# EAGLE design PSU only (EAGLE 9.6.2)

## Sheet 1 of 2
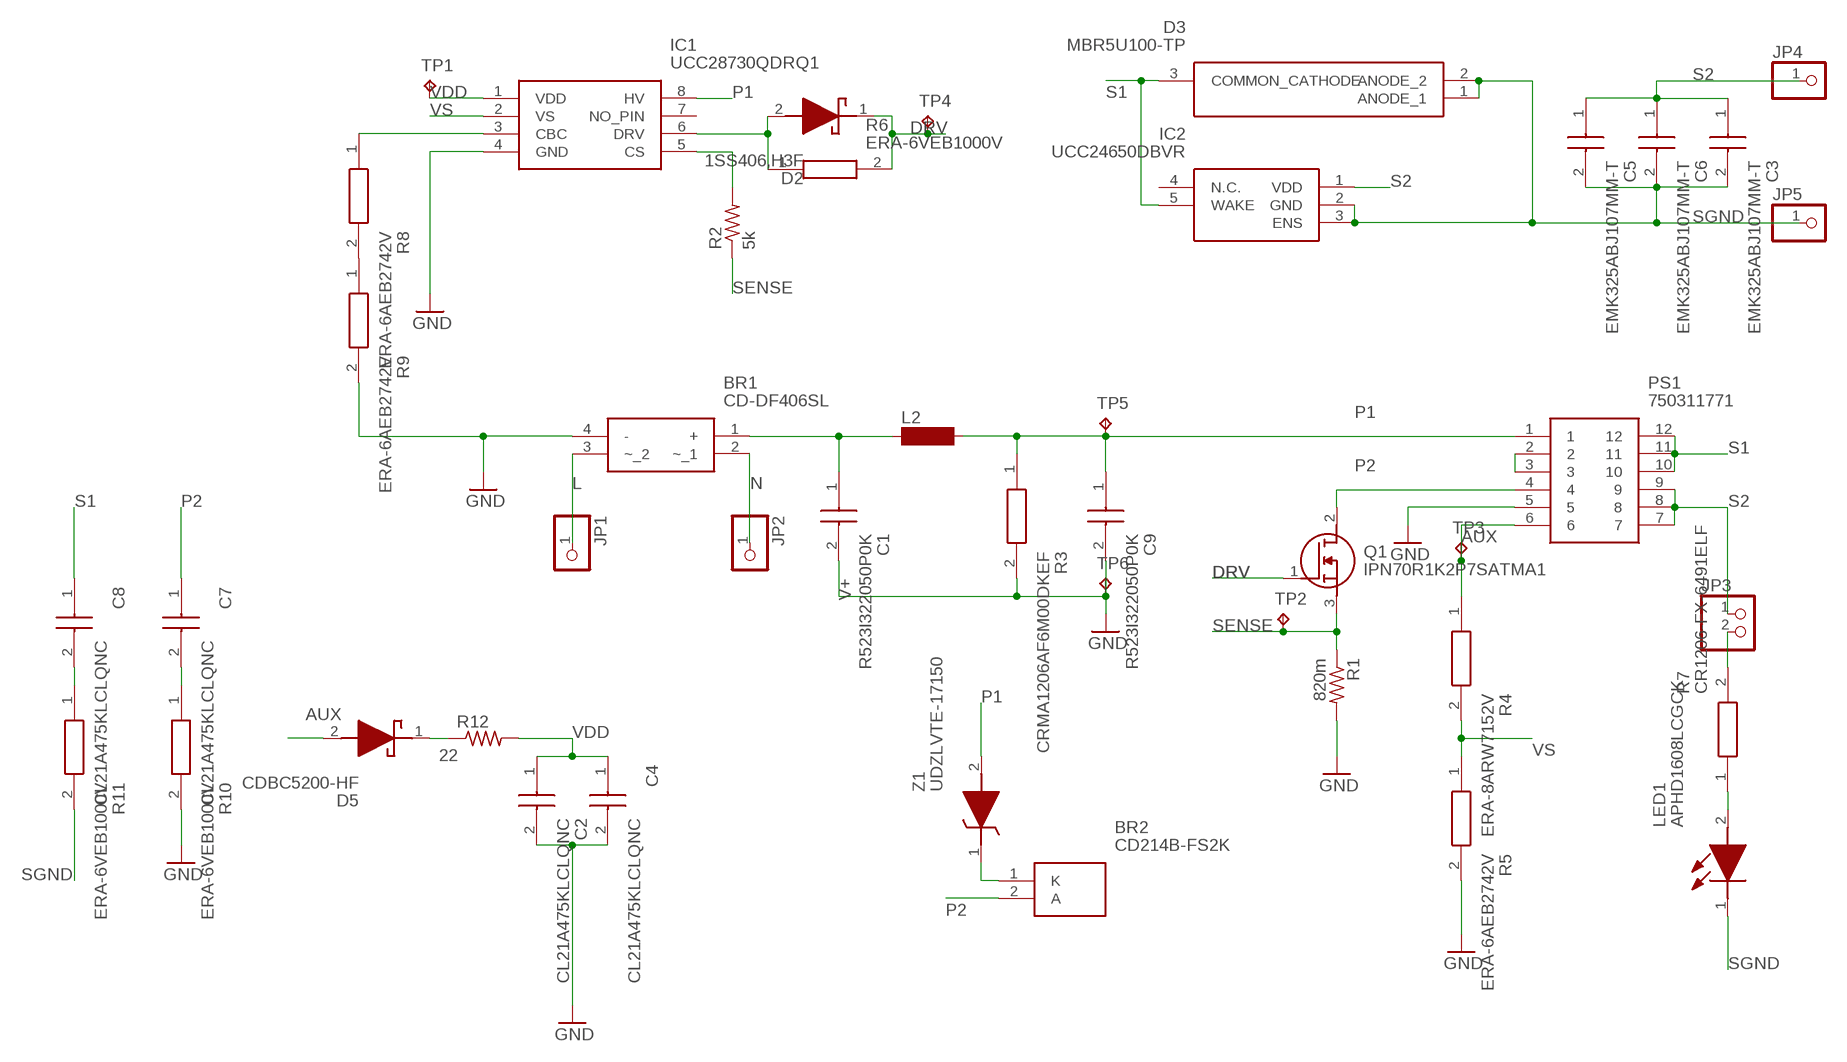
[diagram p0: schematic, sheet 1]

### Parts
BR1  CD-DF406SL  [CDDF406SL]
BR2  CD214B-FS2K  [CD214BFS2K]
C1  R523I322050P0K  [HDRV2W65P0X1500_1X2_1790X585X1]
C2  CL21A475KLCLQNC  [CAPC2012X95N]
C3  EMK325ABJ107MM-T  [CAPC3225X270N]
C4  CL21A475KLCLQNC  [CAPC2012X95N]
C5  EMK325ABJ107MM-T  [CAPC3225X270N]
C6  EMK325ABJ107MM-T  [CAPC3225X270N]
C7  CL21A475KLCLQNC  [CAPC2012X95N]
C8  CL21A475KLCLQNC  [CAPC2012X95N]
C9  R523I322050P0K  [HDRV2W65P0X1500_1X2_1790X585X1]
D2  1SS406,H3F  [SOD2513X115N]
D3  MBR5U100-TP  [MBR5U100TP]
D5  CDBC5200-HF  [DIOM8059X290N]
IC1  UCC28730QDRQ1  [SOIC127P600X175-8N]
IC2  UCC24650DBVR  [SOT95P280X145-5N]
JP1  PINHD-1X1  [1X01]
JP2  PINHD-1X1  [1X01]
JP3  PINHD-1X2  [1X02]
JP4  PINHD-1X1  [1X01]
JP5  PINHD-1X1  [1X01]
L2  MS50SRU1048-471Y  [INDDFN1000X1000X480-2N]
LED1  APHD1608LCGCK  [LEDM168X80N]
PS1  750311771  [750311771]
Q1  IPN70R1K2P7SATMA1  [IPN70R1K2P7SATMA1]
R1  820m  R-US_R0805  [R0805]
R2  5k  R-US_R0805  [R0805]
R3  CRMA1206AF6M00DKEF  [RESC3216X74N]
R4  ERA-8ARW7152V  [ERA8A_(0805)]
R5  ERA-6AEB2742V  [ERA6A_(0805)]
R6  ERA-6VEB1000V  [ERA6VK]
R7  CR1206-FX-6491ELF  [RESC3216X75N]
R8  ERA-6AEB2742V  [ERA6A_(0805)]
R9  ERA-6AEB2742V  [ERA6A_(0805)]
R10  ERA-6VEB1000V  [ERA6VK]
R11  ERA-6VEB1000V  [ERA6VK]
R12  22  R-US_R0805  [R0805]
TP1  TPB1,27  [B1,27]
TP2  TPB1,27  [B1,27]
TP3  TPB1,27  [B1,27]
TP4  TPB1,27  [B1,27]
TP5  TPB1,27  [B1,27]
TP6  TPB1,27  [B1,27]
Z1  UDZLVTE-17150  [SODFL2512X90N]

### Nets
AUX: D5.2(A) PS1.6 R4.1 TP3.TP
DRV: D2.1(K) Q1.1(G) R6.2 TP4.TP
GND: BR1.4(-) C1.2 C2.2 C4.2 C9.2 IC1.4(GND) PS1.5 R1.2 R3.2 R5.2 R9.2 R10.2 TP6.TP
L: BR1.3(~_2) JP1.1
N: BR1.2(~_1) JP2.1
N$1: IC1.5(CS) R2.2
N$2: C7.2 R10.1
N$3: C8.2 R11.1
N$4: D5.1(K) R12.1
N$5: PS1.2 PS1.3
N$6: BR2.1(K) Z1.1(K)
N$7: D2.2(A) IC1.6(DRV) R6.1
N$8: R8.2 R9.1
N$9: LED1.2(A) R7.1
N$10: IC1.3(CBC) R8.1
N$11: JP3.2 R7.2
P1: C9.1 IC1.8(HV) L2.2 PS1.1 R3.1 TP5.TP Z1.2(A)
P2: BR2.2(A) C7.1 PS1.4 Q1.2(D)
S1: C8.1 D3.3(COMMON_CATHODE) IC2.5(WAKE) PS1.10 PS1.11 PS1.12
S2: C3.1 C5.1 C6.1 IC2.1(VDD) JP3.1 JP4.1 PS1.7 PS1.8 PS1.9
SENSE: Q1.3(S) R1.1 R2.1 TP2.TP
SGND: C3.2 C5.2 C6.2 D3.1(ANODE_1) D3.2(ANODE_2) IC2.2(GND) IC2.3(ENS) JP5.1 LED1.1(K) R11.2
V+: BR1.1(+) C1.1 L2.1
VDD: C2.1 C4.1 IC1.1(VDD) R12.2 TP1.TP
VS: IC1.2(VS) R4.2 R5.1
Unconnected: IC1.7(NO_PIN) IC2.4(N.C.)

## Sheet 2 of 2

## Library data of the parts
BR1 = CD-DF406SL:CD-DF406SL: Bridge Rectifiers VRRM 600V 4A SMD DFS Bridge Rectifier Source: Datasheet <http://www.bourns.com/docs/Product-Datasheets/CD-DF4xxSL.pdf>; DESCRIPTION: Bridge Rectifiers VRRM 600V 4A SMD DFS Bridge Rectifier; HEIGHT: 1.55mm; MANUFACTURER_NAME: Bourns; MANUFACTURER_PART_NUMBER: CD-DF406SL; MOUSER_PART_NUMBER: 652-CD-DF406SL; MOUSER_PRICE-STOCK: https://www.mouser.co.uk/ProductDetail/Bourns/CD-DF406SL?qs=zwwtnr6GuIwJRuaaRN0u3A%3D%3D
BR2 = CD214B-FS2K:CD214B-FS2K: Rectifiers 800V 2A Source: Datasheet <http://www.bourns.com/docs/product-datasheets/CD214B-FS2x.pdf>; DESCRIPTION: Rectifiers 800V 2A; HEIGHT: 1.25mm; MANUFACTURER_NAME: Bourns; MANUFACTURER_PART_NUMBER: CD214B-FS2K; MOUSER_PART_NUMBER: 652-CD214B-FS2K; MOUSER_PRICE-STOCK: https://www.mouser.co.uk/ProductDetail/Bourns/CD214B-FS2K?qs=f9yNj16SXrLQSBa%252BXyEv0g%3D%3D
C1 C9 = R523I322050P0K:R523I322050P0K: R52 310 VAC MINI, Film, Metallized Polypropylene, Automotive Safety, 0.22 uF, 10%, 310 VAC, 310 VAC (X2), 310 VAC, 630 VDC, 110C, -40C, 110C, 0.2 % , 100 GOhms, 400 V/us, 2, 1.6 g, 18mm, 12mm, 6mm, Lead Spacing = 15mm, 900 Source: Datasheet <https://content.kemet.com/datasheets/KEM_F3123_R52_X2_310_110C_MIN.pdf>; DESCRIPTION: R52 310 VAC MINI, Film, Metallized Polypropylene, Automotive Safety, 0.22 uF, 10%, 310 VAC, 310 VAC (X2), 310 VAC, 630 VDC, 110C, -40C, 110C, 0.2 % , 100 GOhms, 400 V/us, 2, 1.6 g, 18mm, 12mm, 6mm, Lead Spacing = 15mm, 900; HEIGHT: 12.4mm; MANUFACTURER_NAME: KEMET; MANUFACTURER_PART_NUMBER: R523I322050P0K
C2 C4 C7 C8 = CL21A475KLCLQNC:CL21A475KLCLQNC: CL21A475KLCLQNC Source: Datasheet <https://datasheet.datasheetarchive.com/originals/dk/DKDS-19/374306.pdf>; DESCRIPTION: CL21A475KLCLQNC; HEIGHT: 0.95mm; MANUFACTURER_NAME: SAMSUNG; MANUFACTURER_PART_NUMBER: CL21A475KLCLQNC; MOUSER_PART_NUMBER: 187-CL21A475KLCLQNC; MOUSER_PRICE-STOCK: https://www.mouser.co.uk/ProductDetail/Samsung-Electro-Mechanics/CL21A475KLCLQNC?qs=xZ%2FP%252Ba9zWqblbGH9u%2F3CcQ%3D%3D
C3 C5 C6 = EMK325ABJ107MM-T:EMK325ABJ107MM-T: TAIYO YUDEN - EMK325ABJ107MM-T - CAP, MLCC, X5R, 100UF, 16V, 1210 Source: Datasheet <https://componentsearchengine.com/Datasheets/2/EMK325ABJ107MM-T.pdf>; DESCRIPTION: TAIYO YUDEN - EMK325ABJ107MM-T - CAP, MLCC, X5R, 100UF, 16V, 1210; HEIGHT: 2.7mm; MANUFACTURER_NAME: TAIYO YUDEN; MANUFACTURER_PART_NUMBER: EMK325ABJ107MM-T; MOUSER_PART_NUMBER: 963-EMK325ABJ107MM-T; MOUSER_PRICE-STOCK: https://www.mouser.co.uk/ProductDetail/Taiyo-Yuden/EMK325ABJ107MM-T?qs=I6KAKw0tg2y0ShKbEoYruw%3D%3D
D2 = 1SS406_H3F:1SS406,H3F: Small Signal Schottky Barrier Diode VR=20V, IO=0.05A, in SOD-323 package Source: Datasheet <https://www.mouser.fr/datasheet/2/408/1SS406_datasheet_en_20140301-1853419.pdf>; DESCRIPTION: Small Signal Schottky Barrier Diode VR=20V, IO=0.05A, in SOD-323 package; HEIGHT: 1.15mm; MANUFACTURER_NAME: Toshiba; MANUFACTURER_PART_NUMBER: 1SS406,H3F; MOUSER_PART_NUMBER: 757-1SS406H3F; MOUSER_PRICE-STOCK: https://www.mouser.co.uk/ProductDetail/Toshiba/1SS406H3F?qs=bZr6mbWTK5l7KVDflTlTGA%3D%3D
D3 = MBR5U100-TP:MBR5U100-TP: Diode Schottky 100 V 5A Surface Mount TO-277 Source: Datasheet <https://www.mccsemi.com/pdf/Products/MBR5U100(TO-277).pdf>; DESCRIPTION: Diode Schottky 100 V 5A Surface Mount TO-277; HEIGHT: 1.2mm; MANUFACTURER_NAME: MCC; MANUFACTURER_PART_NUMBER: MBR5U100-TP
D5 = CDBC5200-HF:CDBC5200-HF: Diode 200 V 5A Surface Mount DO-214AB (SMC) Source: Datasheet <https://www.comchiptech.com/admin/files/product/CDBC5150-HF Thru913202. CDBC5200-HF RevB.pdf>; DESCRIPTION: Diode 200 V 5A Surface Mount DO-214AB (SMC); HEIGHT: 2.9mm; MANUFACTURER_NAME: Comchip Technology; MANUFACTURER_PART_NUMBER: CDBC5200-HF; MOUSER_PART_NUMBER: 750-CDBC5200-HF; MOUSER_PRICE-STOCK: https://www.mouser.co.uk/ProductDetail/Comchip-Technology/CDBC5200-HF?qs=XEIV%2Fho1H6e7FEPE4wQmfQ%3D%3D
IC1 = UCC28730QDRQ1:UCC28730QDRQ1: Zero-Power Standby PSR Flyback Controller for Automotive Source: Datasheet <http://www.ti.com/lit/gpn/ucc28730-q1>; DESCRIPTION: Zero-Power Standby PSR Flyback Controller for Automotive; HEIGHT: 1.75mm; MANUFACTURER_NAME: Texas Instruments; MANUFACTURER_PART_NUMBER: UCC28730QDRQ1; MOUSER_PART_NUMBER: 595-UCC28730QDRQ1; MOUSER_PRICE-STOCK: https://www.mouser.co.uk/ProductDetail/Texas-Instruments/UCC28730QDRQ1?qs=HXFqYaX1Q2wArPNWbLj35A%3D%3D
IC2 = UCC24650DBVR:UCC24650DBVR: 200-V Wake-up Monitor for Fast Transient Primary-side Regulation Source: Datasheet <http://www.ti.com/lit/gpn/ucc24650>; DESCRIPTION: 200-V Wake-up Monitor for Fast Transient Primary-side Regulation; HEIGHT: 1.45mm; MANUFACTURER_NAME: Texas Instruments; MANUFACTURER_PART_NUMBER: UCC24650DBVR; MOUSER_PART_NUMBER: 595-UCC24650DBVR; MOUSER_PRICE-STOCK: https://www.mouser.co.uk/ProductDetail/Texas-Instruments/UCC24650DBVR?qs=Lb6%252B0IsOw48DAHpAvVALpw%3D%3D
JP1 JP2 JP4 JP5 = adafruit:PINHD-1X1: Pin header 1x1 for 0.1" spacing With round pins
JP3 = pinhead:PINHD-1X2: PIN HEADER
L2 = inductor-neosid:MS50: INDUCTOR SMD power inductor
LED1 = APHD1608LCGCK:APHD1608LCGCK: Standard LEDs - SMD 0603 Dome Lens LED Green- 570nm Source: Datasheet <http://www.kingbrightusa.com/images/catalog/SPEC/APHD1608LCGCK.pdf>; DESCRIPTION: Standard LEDs - SMD 0603 Dome Lens LED Green- 570nm; HEIGHT: 0.8mm; MANUFACTURER_NAME: Kingbright; MANUFACTURER_PART_NUMBER: APHD1608LCGCK; MOUSER_PART_NUMBER: 604-APHD1608LCGCK; MOUSER_PRICE-STOCK: https://www.mouser.co.uk/ProductDetail/Kingbright/APHD1608LCGCK?qs=AQlKX63v8RvqPbV1LDSVuw%3D%3D
PS1 = 750311771:750311771: Power Transformers WE-FB Flyback 500uH 3A 15V Source: Datasheet <https://katalog.we-online.com/pbs/datasheet/750311771.pdf>; DESCRIPTION: Power Transformers WE-FB Flyback 500uH 3A 15V; HEIGHT: 13.69mm; MANUFACTURER_NAME: Wurth Elektronik; MANUFACTURER_PART_NUMBER: 750311771; MOUSER_PART_NUMBER: 710-750311771; MOUSER_PRICE-STOCK: https://www.mouser.co.uk/ProductDetail/Wurth-Elektronik/750311771?qs=J4sk5G6CMwYUnCXRsU%2FeCw%3D%3D; SPICEPREFIX: X
Q1 = IPN70R1K2P7SATMA1:IPN70R1K2P7SATMA1: N-Channel 700 V 4.5A (Tc) 6.3W (Tc) Surface Mount PG-SOT223 Source: Datasheet <https://www.infineon.com/dgdl/Infineon-IPN70R1K2P7S-DS-v02_00-EN.pdf?fileId=5546d4625f2e26bc015f524b972d6b74>; DESCRIPTION: N-Channel 700 V 4.5A (Tc) 6.3W (Tc) Surface Mount PG-SOT223; HEIGHT: 1.8mm; MANUFACTURER_NAME: Infineon; MANUFACTURER_PART_NUMBER: IPN70R1K2P7SATMA1; MOUSER_PART_NUMBER: 726-IPN70R1K2P7SATM1; MOUSER_PRICE-STOCK: https://www.mouser.co.uk/ProductDetail/Infineon-Technologies/IPN70R1K2P7SATMA1?qs=W0yvOO0ixfF5ZdsayOLPrw%3D%3D
R1 R2 R12 = adafruit:R-US_: RESISTOR, American symbol
R3 = CRMA1206AF6M00DKEF:CRMA1206AF6M00DKEF: Thick Film Resistors - SMD 0.30W 6Mohm .5% AEC-Q200 Source: Datasheet <https://www.vishay.com/doc?68043>; DESCRIPTION: Thick Film Resistors - SMD 0.30W 6Mohm .5% AEC-Q200; HEIGHT: 0.74mm; MANUFACTURER_NAME: Vishay; MANUFACTURER_PART_NUMBER: CRMA1206AF6M00DKEF
R4 = ERA-8ARW7152V:ERA-8ARW7152V: Thin Film Resistors - SMD 1206 71.5Kohms 0.05% 0.25W 10ppm AEC-Q200 Source: Datasheet <https://componentsearchengine.com/Datasheets/1/ERA-8ARW7152V.pdf>; DESCRIPTION: Thin Film Resistors - SMD 1206 71.5Kohms 0.05% 0.25W 10ppm AEC-Q200; HEIGHT: 0.7mm; MANUFACTURER_NAME: Panasonic; MANUFACTURER_PART_NUMBER: ERA-8ARW7152V; MOUSER_PART_NUMBER: 667-ERA-8ARW7152V; MOUSER_PRICE-STOCK: https://www.mouser.com/Search/Refine.aspx?Keyword=667-ERA-8ARW7152V
R5 R8 R9 = ERA-6AEB2742V:ERA-6AEB2742V: Thin Film Resistors - SMD 0805 27.4Kohm 0.1% 25ppm Source: Datasheet <http://industrial.panasonic.com/cdbs/www-data/pdf/RDM0000/AOA0000C307.pdf>; DESCRIPTION: Thin Film Resistors - SMD 0805 27.4Kohm 0.1% 25ppm; HEIGHT: 0.6mm; MANUFACTURER_NAME: Panasonic; MANUFACTURER_PART_NUMBER: ERA-6AEB2742V; MOUSER_PART_NUMBER: 667-ERA-6AEB2742V; MOUSER_PRICE-STOCK: https://www.mouser.co.uk/ProductDetail/Panasonic/ERA-6AEB2742V?qs=nuXzIS8loXHdFK0i8oIpgw%3D%3D
R6 R10 R11 = ERA-6VEB1000V:ERA-6VEB1000V: Thin Film Chip Resistor, High Stability & Reliability, 0805, 0.25W Source: Datasheet <http://industrial.panasonic.com/cdbs/www-data/pdf/RDM0000/RDM0000C331.pdf>; DESCRIPTION: Thin Film Chip Resistor, High Stability & Reliability, 0805, 0.25W; HEIGHT: 0.65mm; MANUFACTURER_NAME: Panasonic; MANUFACTURER_PART_NUMBER: ERA-6VEB1000V; MOUSER_PART_NUMBER: 667-ERA-6VEB1000V; MOUSER_PRICE-STOCK: https://www.mouser.co.uk/ProductDetail/Panasonic/ERA-6VEB1000V?qs=rI7uf1IzohT7rLgO%252BB7NcQ%3D%3D
R7 = CR1206-FX-6491ELF:CR1206-FX-6491ELF: Thick Film Resistors - SMD 6.49K 1% Source: Datasheet <https://componentsearchengine.com/Datasheets/1/CR1206-FX-6491ELF.pdf>; DESCRIPTION: Thick Film Resistors - SMD 6.49K 1%; HEIGHT: 0.75mm; MANUFACTURER_NAME: Bourns; MANUFACTURER_PART_NUMBER: CR1206-FX-6491ELF; MOUSER_PART_NUMBER: 652-CR1206FX-6491ELF; MOUSER_PRICE-STOCK: https://www.mouser.com/Search/Refine.aspx?Keyword=652-CR1206FX-6491ELF
TP1-TP6 = testpad:TP: Test pad
Z1 = UDZLVTE-17150:UDZLVTE-17150: ROHM - UDZLVTE-17150 - Zener Single Diode, 150 V, 200 mW, SOD-323FL, 2 Pins, 150 C Source: Datasheet <https://componentsearchengine.com/Datasheets/2/UDZLVTE-17150.pdf>; DESCRIPTION: ROHM - UDZLVTE-17150 - Zener Single Diode, 150 V, 200 mW, SOD-323FL, 2 Pins, 150 C; HEIGHT: 0.9mm; MANUFACTURER_NAME: ROHM Semiconductor; MANUFACTURER_PART_NUMBER: UDZLVTE-17150; MOUSER_PART_NUMBER: 755-UDZLVTE-17150; MOUSER_PRICE-STOCK: https://www.mouser.co.uk/ProductDetail/ROHM-Semiconductor/UDZLVTE-17150/?qs=uPV7ZbtEjc5dJhqDrwh%252BYA%3D%3D

## Board
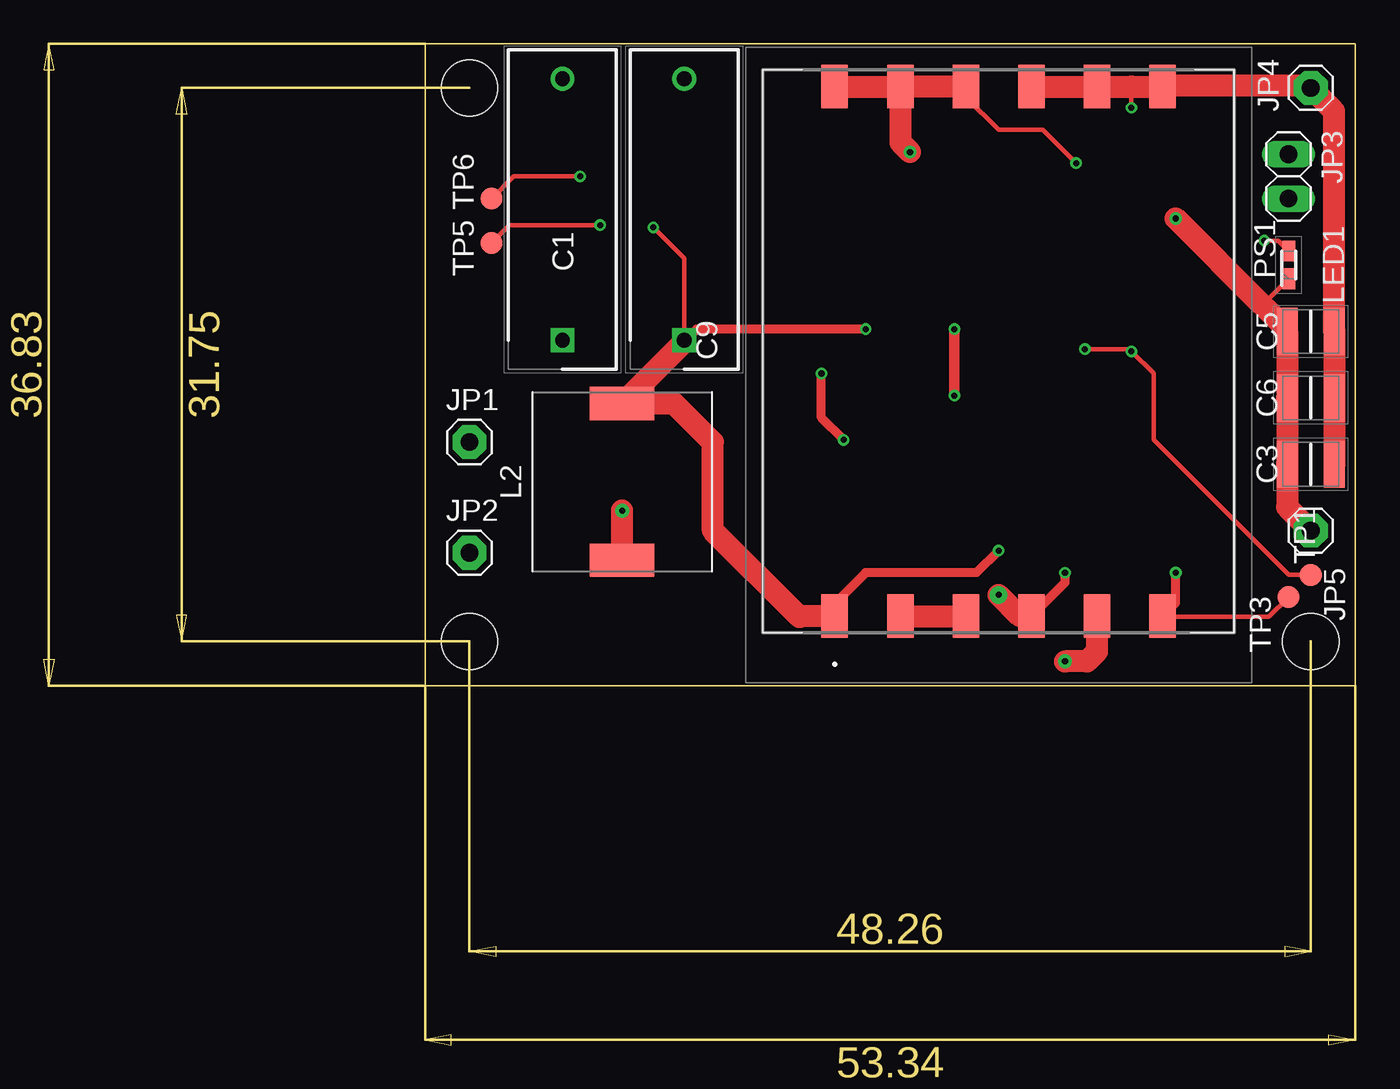
[diagram p1: board, top side]
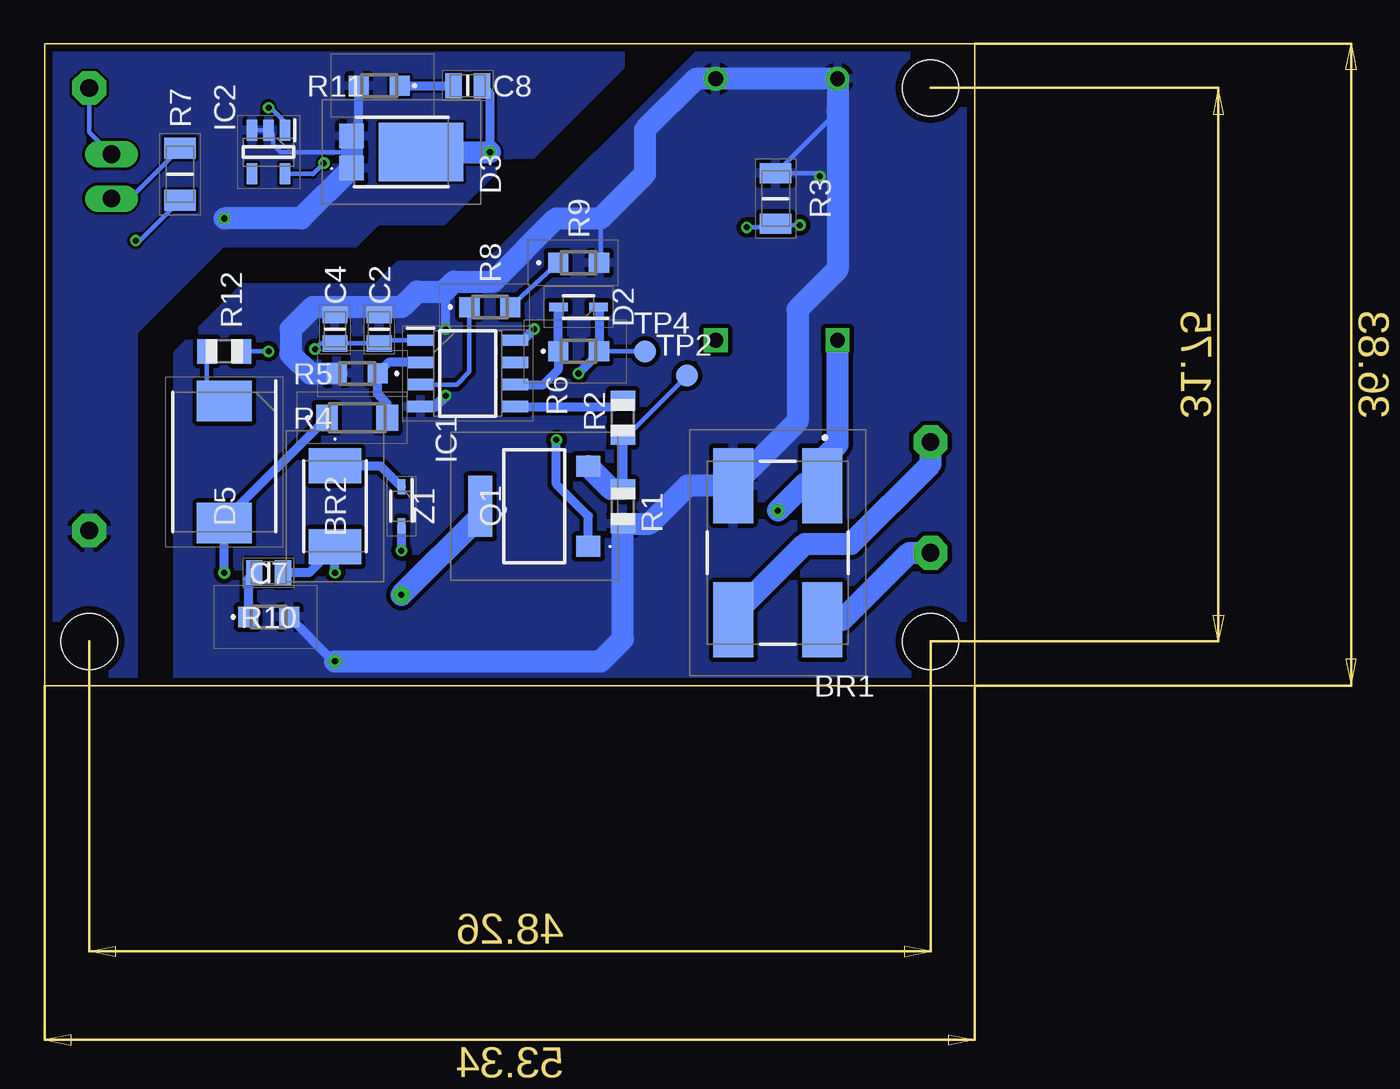
[diagram p2: board, bottom side, seen from below]

Size 53.34 x 36.83 mm. Coordinates in mm from the lower left corner, seen from the top.
Outline: 0,36.83 53.34,36.83 53.34,0 0,0 0,36.83
Copper layers (1*16): Top 0.035mm / dielectric 1.5mm / Bottom 0.035mm
Design rules "NOA Eagle Rule 2016-06-12 *": minimum track width 6mil, minimum drill 0.3mm, track to track 6mil, track to pad 6mil, pad to pad 6mil, via to via 6mil, smd to smd 0mil, copper to edge 0.4mm, drill to drill 10mil, minimum pad ring 10mil, minimum via ring 6mil, stop-mask expansion 2mil, vias tented up to drill 25mil, thermal gap 10mil
Holes 3.2 mm at 2.54,34.29 50.8,2.54 2.54,2.54

### Footprints (pad centres in the part's own frame; a part is rotated, then mirrored left to right if it is on the bottom)
CDDF406SL = smd 2.3 x 4.3: 1 2.55,3.85; 2 2.55,-3.85; 3 -2.55,-3.85; 4 -2.55,3.85
CD214BFS2K = smd 2 x 3: 1 -2.325,0; 2 2.325,0
HDRV2W65P0X1500_1X2_1790X585X1 = drill 0.85 pad 1.275 square: 1 0,0 | drill 0.85 pad 1.275: 2 15,0
CAPC2012X95N = smd 0.94 x 1.43: 1 -0.82,0; 2 0.82,0
CAPC3225X270N = smd 1.22 x 2.72: 1 -1.35,0; 2 1.35,0
SOD2513X115N = smd 1.075 x 0.5: 1 -1.15,0; 2 1.15,0
MBR5U100TP = smd 1.4 x 1.4: 1 -2.855,-0.92; 2 -2.855,0.92 | smd 4.86 x 3.36: 3 1.125,0
DIOM8059X290N = smd 2.3 x 3.15: 1 -3.5,0; 2 3.5,0
SOIC127P600X175-8N = smd 1.528 x 0.65: 1 -2.711,1.905; 2 -2.711,0.635; 3 -2.711,-0.635; 4 -2.711,-1.905; 5 2.711,-1.905; 6 2.711,-0.635; 7 2.711,0.635; 8 2.711,1.905
SOT95P280X145-5N = smd 1.2 x 0.6: 1 -1.25,0.95; 2 -1.25,0; 3 -1.25,-0.95; 4 1.25,-0.95; 5 1.25,0.95
1X01 = drill 1.016 pad 1.93 octagon: 1 0,0
1X02 = drill 1.016 long: 1 -1.27,0; 2 1.27,0
INDDFN1000X1000X480-2N = smd 1.91 x 3.7: 1 -4.495,0; 2 4.495,0
LEDM168X80N = smd 1.2 x 0.75: 1 -0.8,0; 2 0.8,0
750311771 = smd 2.5 x 1.52: 1 -15.19,9.4; 2 -15.19,5.64; 3 -15.19,1.88; 4 -15.19,-1.88; 5 -15.19,-5.64; 6 -15.19,-9.4; 7 15.19,-9.4; 8 15.19,-5.64; 9 15.19,-1.88; 10 15.19,1.88; 11 15.19,5.64; 12 15.19,9.4
IPN70R1K2P7SATMA1 = smd 1.2 x 1.4: 1 -2.3,-3.1; 3 2.3,-3.1 | smd 3.5 x 1.4: 2 0,3.1
R0805 = smd 1.1 x 1.4: 1 -1,0; 2 1,0
RESC3216X74N = smd 1.15 x 1.8: 1 -1.45,0; 2 1.45,0
ERA8A_(0805) = smd 1.25 x 1.5: 1 -1.725,0; 2 1.725,0
ERA6A_(0805) = smd 1.15 x 1.15: 1 -1.175,0; 2 1.175,0
ERA6VK = smd 1.15 x 1.15: 1 -1.175,0; 2 1.175,0
RESC3216X75N = smd 1.2 x 1.8: 1 -1.5,0; 2 1.5,0
B1,27 = smd 1.27 x 1.27: TP 0,0
SODFL2512X90N = smd 0.87 x 0.42: 1 -1.125,0; 2 1.125,0

### Placement (x,y rotation side)
BR1  11.3,7.62 0 bottom
BR2  36.7,10.29 270 bottom
C1  7.87,19.81 90 top
C2  34.16,20.45 90 bottom
C3  50.8,12.7 180 top
C4  36.7,20.45 90 bottom
C5  50.8,20.32 180 top
C6  50.8,16.51 180 top
C7  40.51,6.48 180 bottom
C8  29.08,34.42 180 bottom
C9  14.86,19.81 90 top
D2  22.73,21.72 180 bottom
D3  32.89,30.61 0 bottom
D5  43.05,12.83 270 bottom
IC1  29.08,17.91 0 bottom
IC2  40.51,30.61 270 bottom
JP1  2.54,13.97 0 top
JP2  2.54,7.62 0 top
JP3  49.53,29.21 270 top
JP4  50.8,34.29 0 top
JP5  50.8,8.89 0 top
L2  11.3,11.68 90 top
LED1  49.53,24.13 90 top
PS1  32.89,19.18 90 top
Q1  25.27,10.29 90 bottom
R1  20.19,10.29 270 bottom
R2  20.19,15.37 90 bottom
R3  11.43,27.94 90 bottom
R4  35.43,15.37 0 bottom
R5  35.43,17.91 180 bottom
R6  22.73,19.18 0 bottom
R7  45.59,29.34 90 bottom
R8  27.81,21.72 0 bottom
R9  22.73,24.26 0 bottom
R10  40.51,3.94 0 bottom
R11  34.16,34.42 180 bottom
R12  43.05,19.18 0 bottom
TP1  50.8,6.35 0 top
TP2  16.51,17.78 0 bottom
TP3  49.53,5.08 0 top
TP4  18.92,19.18 0 bottom
TP5  3.81,25.4 0 top
TP6  3.81,27.94 0 top
Z1  32.89,10.29 270 bottom

### Tracks (layer width: path | path; a pad name or v marks a point on that pad's centre or on a via)
AUX  (via drill 0.35 pad 0.7)
  Top 0.254: TP3.TP 48.39,3.94 42.34,3.94 PS1.6
  Top 0.508: PS1.6 43.05,4.75 v43.05,6.48
  Bottom 0.508: R4.1 43.05,9.47 D5.2 v43.05,6.48
DRV  (via drill 0.35)
  Top 0.508: v24,14.1 22.73,15.37 v22.73,17.91
  Bottom 0.254: R6.2 TP4.TP
  Bottom 0.508: D2.1 21.56,21.69 R6.2 21.56,19.08 v22.73,17.91 | Q1.1 22.17,9.73 24,11.56 v24,14.1
GND  (via drill 0.35, 0.35 pad 0.8)
  Top 0.254: TP6.TP 5.08,29.21 v8.89,29.21
  Top 0.61: v30.35,16.64 v30.35,20.45
  Top 1.27: PS1.5 38.53,1.96 37.97,1.4 v36.7,1.4
  Bottom 0.254: R9.2 21.46,24.35 21.46,26.8 | 7.87,33.02 7.87,32.95 R3.2 9.07,29.39 v8.89,29.21
  Bottom 0.508: v30.35,20.45 30.35,22.32 30.64,22.61 | R10.2 36.8,1.4 v36.7,1.4
  Bottom 0.61: IC1.4 30.99,16 v30.35,16.64
  Bottom 1.27: R5.2 38.14,17.91 39.24,19.01 39.24,20.45 37.97,21.72 32.88,21.72 31.99,22.61 30.64,22.61 30.45,22.61 29.88,23.18 27.62,23.18 24,26.8 21.46,26.8 18.92,29.34 18.92,31.88 15.99,34.81 C9.2 C1.2 7.87,33.02 7.87,23.88 10.16,21.59 10.16,15.16 BR1.4 16.47,11.47 18.65,9.29 R1.2 20.19,2.67 21.46,1.4 v36.7,1.4
  pour Bottom (isolate 0.254): -27.22,-12.74 45.72,-12.74 45.72,19.05 41.91,22.86 34.29,22.86 33.02,24.13 27.94,24.13 15.24,36.83 0.13,36.83
L
  Bottom 1.27: BR1.3 13.85,4.02 9.75,8.13 7.11,8.13 2.54,12.7 JP1.1
N
  Bottom 1.27: BR1.2 7.61,3.77 3.76,7.62 JP2.1
N$1
  Bottom 0.508: IC1.5 20.56,16 R2.2
N$2
  Bottom 0.508: C7.2 41.69,6.12 R10.1
N$3
  Bottom 0.508: R11.1 C8.2
N$4
  Bottom 0.254: D5.1 44.05,17.33 R12.1
N$5
  Top 1.27: PS1.2 PS1.3
N$6
  Bottom 0.508: BR2.1 34.09,12.61 Z1.1
N$7
  Bottom 0.508: D2.2 23.91,21.69 R6.1 23.91,18.11 24.74,17.27 IC1.6
N$8
  Bottom 0.254: R8.2 26.64,21.73 R9.1
N$9  (via drill 0.35)
  Top 0.254: v48.13,25.53 48.93,25.53 LED1.2
  Bottom 0.254: R7.1 47.9,25.53 v48.13,25.53
N$10
  Bottom 0.254: R8.1 28.99,18 29.72,17.27 IC1.3
N$11
  Bottom 0.254: JP3.2 48.49,27.94 R7.2
P1  (via drill 0.35)
  Top 0.254: TP5.TP 4.83,26.42 v10.03,26.42 | C9.1 14.86,24.51 v13.08,26.29
  Top 0.508: v32.89,7.75 31.62,6.48 25.27,6.48 23.49,4.7 PS1.1 | v25.27,20.45 15.57,20.45 14.86,19.73
  Top 1.27: PS1.1 21.51,3.99 21.46,3.94 16.51,8.89 16.51,13.97 14.3,16.18 L2.2 14.86,19.73 C9.1
  Bottom 0.254: v10.03,26.42 11.36,26.42 R3.1 11.63,26.29 v13.08,26.29
  Bottom 0.508: Z1.2 v32.89,7.75 | IC1.8 25.91,19.81 v25.27,20.45
P2  (via drill 0.35, 0.35 pad 1)
  Top 0.508: PS1.4 36.7,5.92 v36.7,6.48
  Top 1.27: PS1.4 34.11,3.99 v32.89,5.21
  Bottom 0.508: v36.7,6.48 BR2.2 38.19,6.48 C7.1
  Bottom 1.27: Q1.2 28.37,9.73 v32.89,5.21
S1  (via drill 0.35, 0.35 pad 0.7)
  Top 0.254: v37.34,29.97 35.43,31.88 32.89,31.88 31.01,33.76 PS1.10
  Top 1.27: PS1.12 PS1.11 | PS1.10 PS1.11 | PS1.11 27.25,31.17 v27.81,30.61
  Bottom 0.254: IC2.5 37.99,29.36 37.97,29.34 v37.34,29.97 | D3.3 30.35,30.61
  Bottom 0.508: C8.1 27.81,33.97 v27.81,30.61
  Bottom 1.27: 30.35,30.61 v27.81,30.61
S2  (via drill 0.35)
  Top 0.254: 40.51,34.37 v40.51,33.15
  Top 1.27: PS1.9 PS1.8 40.51,34.37 PS1.7 42.34,34.42 50.67,34.42 JP4.1 52.12,32.97 52.12,20.35 C5.1 C6.1 C3.1
  Bottom 0.254: IC2.1 39.54,31.88 39.54,32.3 40.39,33.15 v40.51,33.15 | JP4.1 50.8,31.75 JP3.1
SENSE
  Bottom 0.254: R2.1 19.92,14.37 TP2.TP
  Bottom 0.508: R2.1 R1.1
  Bottom 1.27: Q1.3 20.87,11.29 R1.1
SGND  (via drill 0.35 pad 0.7)
  Top 0.254: LED1.1 48.02,21.82
  Top 1.27: JP5.1 49.45,10.24 C3.2 C6.2 C5.2 49.45,20.4 48.18,21.67 | 48.02,21.82 v43.05,26.8
  Bottom 0.254: IC2.3 IC2.2 40.24,31.59 40.24,31.02 39.83,30.61 35.75,30.61
  Bottom 0.508: D3.2 35.34,31.94 R11.2
  Bottom 1.27: D3.2 35.75,30.61 D3.1 38.64,26.8 v43.05,26.8
  pour Bottom: 20.32,36.83 53.34,36.83 53.34,-13.97 48.26,-13.97 48.26,20.32 43.18,25.4 35.56,25.4 34.29,26.67 30.48,26.67 26.67,30.48 25.4,30.48 20.32,35.56
V+  (via drill 0.35 pad 0.8)
  Top 1.27: L2.1 v11.3,10.03
  Bottom 1.27: v11.3,10.03 9.73,11.61 8.89,11.61 BR1.1 8.75,12.96 7.87,13.84 C1.1
VDD  (via drill 0.35)
  Top 0.254: v37.85,19.3 40.39,19.3 v40.51,19.18 41.78,17.91 41.78,14.1 49.53,6.35 TP1.TP
  Bottom 0.254: IC1.1 33.98,19.81 C2.1 C4.1 37.52,19.63 v37.85,19.3 | R12.2 v40.51,19.18
VS
  Bottom 0.508: IC1.2 33.62,18.54 R5.1 34.26,16.73 33.71,16.18 R4.2